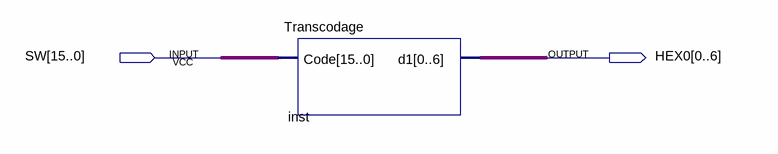
[diagram p0: schematic sheet]
// Quartus schematic AffichageCode_DE2_115.bdf as structural Verilog: 1 symbols, 2 pins
module AffichageCode_DE2_115 (
  input  [15:0] SW,
  output [0:6] HEX0
);

  Transcodage inst (.Code(SW), .d1(HEX0));
endmodule
